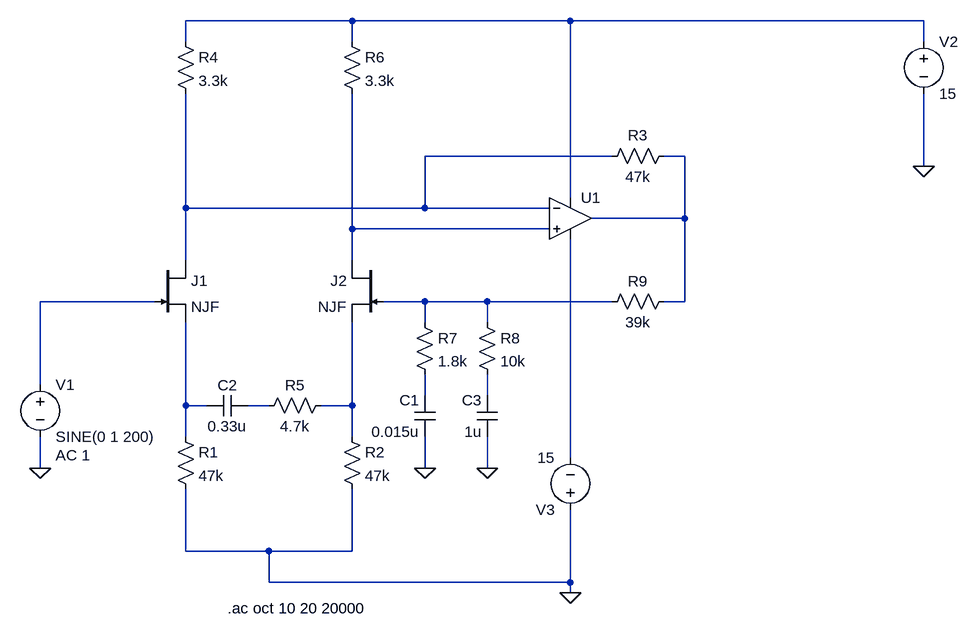
[diagram p0: schematic Head Amp.asc]
Head Amp.asc, the LTspice schematic file:
Version 4
SHEET 1 880 680
WIRE -448 -256 -704 -256
WIRE -112 -256 -448 -256
WIRE 432 -256 -112 -256
WIRE -704 -224 -704 -256
WIRE -448 -224 -448 -256
WIRE 432 -224 432 -256
WIRE -48 -48 -336 -48
WIRE 64 -48 32 -48
WIRE 432 -32 432 -144
WIRE -112 16 -112 -256
WIRE -704 32 -704 -144
WIRE -336 32 -336 -48
WIRE -336 32 -704 32
WIRE -144 32 -336 32
WIRE 64 48 64 -48
WIRE 64 48 -80 48
WIRE -448 64 -448 -144
WIRE -144 64 -448 64
WIRE -704 112 -704 32
WIRE -448 112 -448 64
WIRE -752 176 -928 176
WIRE -336 176 -400 176
WIRE -240 176 -336 176
WIRE -48 176 -240 176
WIRE 64 176 64 48
WIRE 64 176 32 176
WIRE -336 208 -336 176
WIRE -240 208 -240 176
WIRE -928 304 -928 176
WIRE -336 320 -336 288
WIRE -240 320 -240 288
WIRE -704 336 -704 208
WIRE -672 336 -704 336
WIRE -576 336 -608 336
WIRE -448 336 -448 208
WIRE -448 336 -496 336
WIRE -704 384 -704 336
WIRE -448 384 -448 336
WIRE -112 416 -112 80
WIRE -928 432 -928 384
WIRE -336 432 -336 384
WIRE -240 432 -240 384
WIRE -704 560 -704 464
WIRE -576 560 -704 560
WIRE -448 560 -448 464
WIRE -448 560 -576 560
WIRE -576 608 -576 560
WIRE -112 608 -112 496
WIRE -112 608 -576 608
WIRE -112 624 -112 608
FLAG -928 432 0
FLAG -112 624 0
FLAG 432 -32 0
FLAG -336 432 0
FLAG -240 432 0
SYMBOL voltage -928 288 R0
WINDOW 123 24 124 Left 2
WINDOW 39 0 0 Left 2
SYMATTR Value2 AC 1
SYMATTR InstName V1
SYMATTR Value SINE(0 1 200)
SYMBOL res -720 -240 R0
SYMATTR InstName R4
SYMATTR Value 3.3k
SYMBOL cap -608 320 R90
WINDOW 0 0 32 VBottom 2
WINDOW 3 32 32 VTop 2
SYMATTR InstName C2
SYMATTR Value 0.33u
SYMBOL voltage 432 -240 R0
WINDOW 123 0 0 Left 2
WINDOW 39 0 0 Left 2
SYMATTR InstName V2
SYMATTR Value 15
SYMBOL voltage -112 512 R180
WINDOW 123 0 0 Left 2
WINDOW 39 0 0 Left 2
SYMATTR InstName V3
SYMATTR Value 15
SYMBOL Opamps\\UniversalOpamp2 -112 48 R0
SYMATTR InstName U1
SYMBOL res -464 -240 R0
SYMATTR InstName R6
SYMATTR Value 3.3k
SYMBOL njf -752 112 R0
SYMATTR InstName J1
SYMBOL njf -400 112 M0
SYMATTR InstName J2
SYMBOL res -720 368 R0
SYMATTR InstName R1
SYMATTR Value 47k
SYMBOL res -464 368 R0
SYMATTR InstName R2
SYMATTR Value 47k
SYMBOL res 48 -64 R90
WINDOW 0 0 56 VBottom 2
WINDOW 3 32 56 VTop 2
SYMATTR InstName R3
SYMATTR Value 47k
SYMBOL res -480 320 R90
WINDOW 0 0 56 VBottom 2
WINDOW 3 32 56 VTop 2
SYMATTR InstName R5
SYMATTR Value 4.7k
SYMBOL res -352 192 R0
SYMATTR InstName R7
SYMATTR Value 1.8k
SYMBOL res -256 192 R0
SYMATTR InstName R8
SYMATTR Value 10k
SYMBOL cap -320 384 R180
WINDOW 0 24 56 Left 2
WINDOW 3 24 8 Left 2
SYMATTR InstName C1
SYMATTR Value 0.015u
SYMBOL cap -224 384 R180
WINDOW 0 24 56 Left 2
WINDOW 3 24 8 Left 2
SYMATTR InstName C3
SYMATTR Value 1u
SYMBOL res 48 160 R90
WINDOW 0 0 56 VBottom 2
WINDOW 3 32 56 VTop 2
SYMATTR InstName R9
SYMATTR Value 39k
TEXT -640 648 Left 2 !.ac oct 10 20 20000

The netlist it stands for:
* Head Amp.asc
V1 N005 0 SINE(0 1 200) AC 1
R4 N001 N002 3.3k
C2 N010 N009 0.33u
V2 N001 0 15
V3 0 N012 15
XU1 N004 N002 N001 N012 N003 level.2 Avol=1Meg GBW=10Meg Slew=10Meg ilimit=25m rail=0 Vos=0 phimargin=45 en=0 enk=0 in=0 ink=0 Rin=500Meg  ; pins IN+ IN- V+ V- OUT
R6 N001 N004 3.3k
J1 N002 N005 N009 NJF
J2 N004 N006 N011 NJF
R1 N009 0 47k
R2 N011 0 47k
R3 N003 N002 47k
R5 N011 N010 4.7k
R7 N006 N007 1.8k
R8 N006 N008 10k
C1 0 N007 0.015u
C3 0 N008 1u
R9 N003 N006 39k
.model NJF NJF
.model PJF PJF
.lib standard.jft
.ac oct 10 20 20000
.lib UniversalOpamps2.sub
.backanno
.end